# Altium schematic sheet Version.SchDoc
size A4
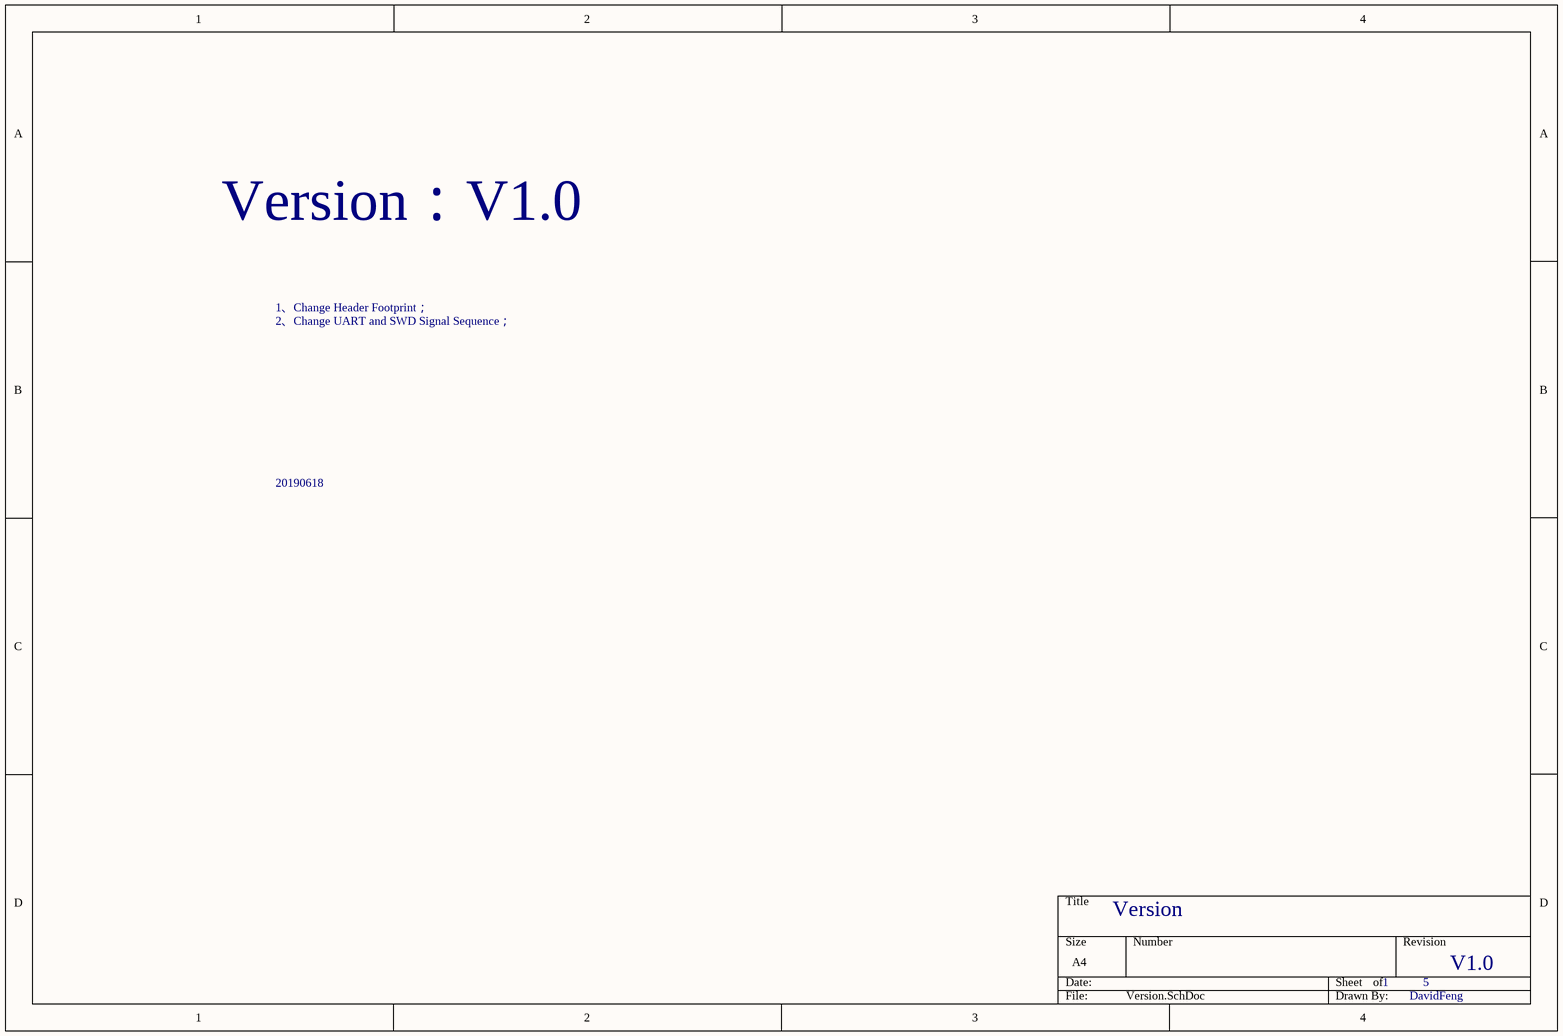
[diagram p0: Version.SchDoc]

## Notes on the sheet
- Version：V1.0
- 1、Change Header Footprint；
- 2、Change UART and SWD Signal Sequence；
- 20190618
- Version
- 1
- 5
- V1.0
- DavidFeng